# Altium project TeensyBreakoutTemplate.PrjPcb
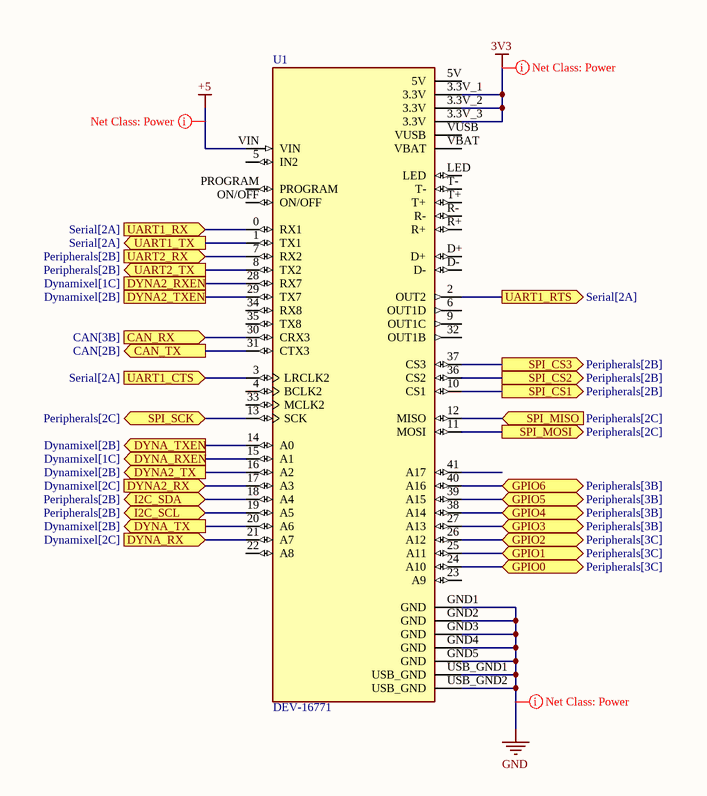
[diagram p0: Main.SchDoc]
6 sheets, 30 parts. Net scope: flat (ports and power ports of the same name join across sheets).
Board file: PCB.PcbDoc
Sheets:
  Main.SchDoc
  Power.SchDoc
  Serial.SchDoc
  Peripherals.SchDoc
  CAN.SchDoc
  Dynamixel.SchDoc

## Sheet Main.SchDoc
size A; SheetNumber: 1; SheetTotal: 6

### Parts
U1  DEV-16771  [MODULE_DEV-16771]

### Ports
CAN_RX (in, see CAN[3B]), CAN_TX (out, see CAN[2B]), DYNA2_RX (in, see Dynamixel[2C]), DYNA2_RXEN (see Dynamixel[1C]), DYNA2_TX (out, see Dynamixel[2B]), DYNA2_TXEN (see Dynamixel[2B]), DYNA_RX (in, see Dynamixel[2C]), DYNA_RXEN (out, see Dynamixel[1C]), DYNA_TX (out, see Dynamixel[2B]), DYNA_TXEN (out, see Dynamixel[2B]), GPIO0 (bidir, see Peripherals[3C]), GPIO1 (bidir, see Peripherals[3C]), GPIO2 (bidir, see Peripherals[3C]), GPIO3 (bidir, see Peripherals[3B]), GPIO4 (bidir, see Peripherals[3B]), GPIO5 (bidir, see Peripherals[3B]), GPIO6 (bidir, see Peripherals[3B]), I2C_SCL (bidir, see Peripherals[2B]), I2C_SDA (bidir, see Peripherals[2B]), SPI_CS1 (out, see Peripherals[2B]), SPI_CS2 (out, see Peripherals[2B]), SPI_CS3 (out, see Peripherals[2B]), SPI_MISO (in, see Peripherals[2C]), SPI_MOSI (out, see Peripherals[2C]), SPI_SCK (bidir, see Peripherals[2C]), UART1_CTS (in, see Serial[2A]), UART1_RTS (out, see Serial[2A]), UART1_RX (in, see Serial[2A]), UART1_TX (out, see Serial[2A]), UART2_RX (in, see Peripherals[2B]), UART2_TX (out, see Peripherals[2B])

### Nets
3V3: U1.3.3V_1(3.3V) U1.3.3V_2(3.3V) U1.3.3V_3(3.3V)
+5: U1.VIN
GND: U1.GND1(GND) U1.GND2(GND) U1.GND3(GND) U1.GND4(GND) U1.GND5(GND) U1.USB_GND1(USB_GND) U1.USB_GND2(USB_GND)
NetIC1_1: U1.14(A0) ; port DYNA_TXEN
NetIC1_2: U1.20(A6) ; port DYNA_TX
NetIC1_4: U1.29(TX7) ; port DYNA2_TXEN
NetIC1_5: U1.16(A2) ; port DYNA2_TX
NetIC2_1: U1.15(A1) ; port DYNA_RXEN
NetIC2_3: U1.21(A7) ; port DYNA_RX
NetIC2_4: U1.28(RX7) ; port DYNA2_RXEN
NetIC2_6: U1.17(A3) ; port DYNA2_RX
NetJ1_3: U1.7(RX2) ; port UART2_RX
NetJ1_4: U1.8(TX2) ; port UART2_TX
NetJ1_5: U1.18(A4) ; port I2C_SDA
NetJ1_6: U1.19(A5) ; port I2C_SCL
NetJ1_7: U1.37(CS3) ; port SPI_CS3
NetJ1_8: U1.36(CS2) ; port SPI_CS2
NetJ1_9: U1.10(CS1) ; port SPI_CS1
NetJ1_10: U1.13(SCK) ; port SPI_SCK
NetJ1_11: U1.12(MISO) ; port SPI_MISO
NetJ1_12: U1.11(MOSI) ; port SPI_MOSI
NetJ2_6: U1.40(A16) ; port GPIO6
NetJ2_7: U1.39(A15) ; port GPIO5
NetJ2_8: U1.38(A14) ; port GPIO4
NetJ2_9: U1.27(A13) ; port GPIO3
NetJ2_10: U1.26(A12) ; port GPIO2
NetJ2_11: U1.25(A11) ; port GPIO1
NetJ2_12: U1.24(A10) ; port GPIO0
NetU1_0: U1.0(RX1) ; port UART1_RX
NetU1_1: U1.1(TX1) ; port UART1_TX
NetU1_2: U1.2(OUT2) ; port UART1_RTS
NetU1_3: U1.3(LRCLK2) ; port UART1_CTS
NetU1_30: U1.30(CRX3) ; port CAN_RX
NetU1_31: U1.31(CTX3) ; port CAN_TX

Not connected (* = marked no-connect by the designer): U1 4(BCLK2) 5(IN2) 5V 6(OUT1D) 9(OUT1C) 22(A8) 23(A9) 32(OUT1B) 33(MCLK2) 34(RX8) 35(TX8) 41(A17) D+ D- LED ON/OFF PROGRAM R+ R- T+ T- VBAT VUSB

### Layout directives
net class Power: 3V3, +5, GND

### Library data of the parts
U1 = DEV-16771: RT1062 Teensy 4.1 i.MX ARM Cortex-M7 MPU Embedded Evaluation Board; MF: {'manufacturer': u'SparkFun Electronics'}; Package: None; Availability: Unavailable; Value: *; MP: DEV-16771; Price: None

## Sheet Power.SchDoc
size A; SheetNumber: 2; SheetTotal: 6
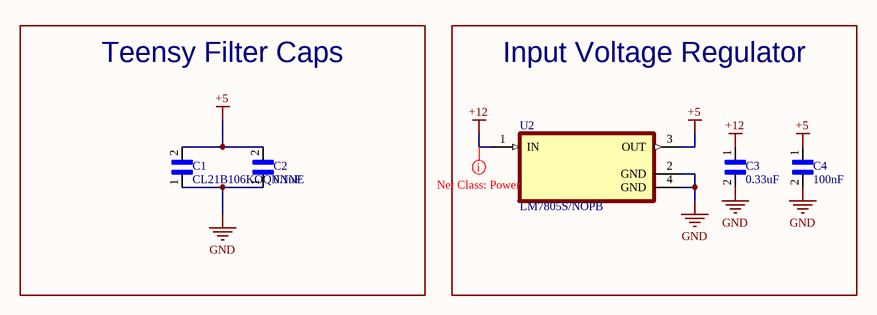
[diagram p1: Power.SchDoc]

### Parts
C1  CL21B106KOQNNNE  [CAPC2012X140N]
C2  0.1uF  [CAPC2012X140N]
C3  0.33uF  [CAPC2012X100N]
C4  100nF  [CAPC2012X140N]
U2  LM7805S/NOPB  [TO254P1524X483-4N]

### Blocks framed on the sheet
Teensy Filter Caps: C1 C2
Input Voltage Regulator: C3 C4 U2

### Nets
+5: C1.2 C2.2 C4.1 U2.3(OUT)
+12: C3.1 U2.1(IN)
GND: C1.1 C2.1 C3.2 C4.2 U2.2(GND) U2.4(GND)

### Layout directives
net class Power: +12

### Library data of the parts
C1 = CL21B106KOQNNNE: Cap Ceramic 10uF 16V X7R 10% Pad SMD 0805 125C T/R; MF: {'manufacturer': u'Samsung'}; Package: None; Availability: Unavailable; Value: *; MP: CL21B106KOQNNNE; Price: None
C2 C4 = 08055G104ZAT1A: CAPACITOR, 0805, 100NF, 50V; Capacitor Application:General Purpose; Dielectric Characteristic:Y5V; Capacitance:0.1ÂµF; Capacitance Tolerance:-20% to +80%; Voltage Rating:50V; Capacitor Case Style:0805; Capacitor Mounting:SMD; Operating Temperature Range:-25Â°C to +85Â°C; SVHC:No SVHC (15-Dec-2010); External Depth:0.95mm; External Length / Height:2mm; External Width:1.25mm; Insulation Resistance:10000Mohm; No. of Pins:2; Operating Temperature Max:85Â°C; Operating Temperature Min:-25Â°C; Package / Case:0805; Reel Quantity:3000; Tape Width:8mm; Temperature Coefficient:+22%, -82%; Terminal Type:Surface Mount (SMD, SMT); Termination Type:SMD; Tolerance +:80%; Tolerance -:20%; Voltage Rating VDC:50V; MF: {'manufacturer': u'AVX'}; Package: None; Availability: Unavailable; Value: *; MP: 08055G104ZAT1A; Price: None
C3 = C0805C334J5RECAUTO: MF: {'manufacturer': u'KEMET'}; Value: *; Package: None; MP: C0805C334J5RECAUTO; Availability: Unavailable; Price: None
U2 = LM7805S/NOPB: MF: {'manufacturer': u'Texas Instruments'}; Price: None; Package: None; Availability: Unavailable; MP: LM7805S/NOPB; Value: *

## Sheet Serial.SchDoc
size A; SheetNumber: 3; SheetTotal: 6
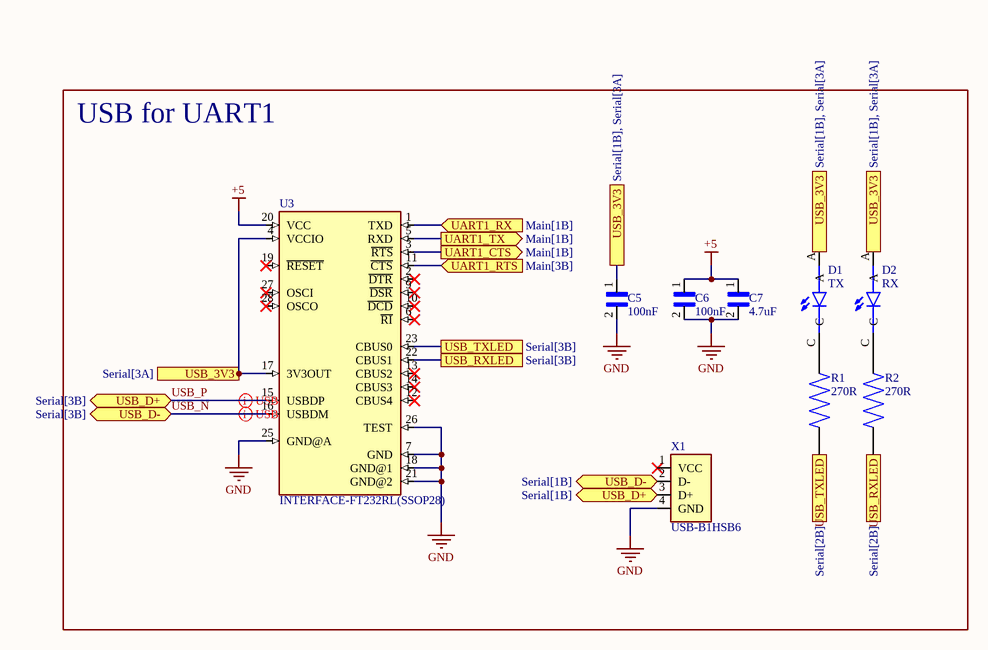
[diagram p2: Serial.SchDoc]

### Parts
C5  100nF  [CAPC2012X140N]
C6  100nF  [CAPC2012X140N]
C7  4.7uF  [CAPC2012X140N]
D1  TX  [LEDC3216X110]
D2  RX  [LEDC3216X110]
R1  270R  [RESC2012X55N]
R2  270R  [RESC2012X55N]
U3  INTERFACE-FT232RL(SSOP28)  [SSOP28-0.65-10.2X5.2MM]
X1  USB-B1HSB6  [OST_USB-B1HSB6]

### Blocks framed on the sheet
USB for UART1: C5-C7 D1 D2 R1 R2 U3 X1

### Ports
UART1_CTS (out, see Main[1B]), UART1_RTS (in, see Main[3B]), UART1_RX (in, see Main[1B]), UART1_TX (out, see Main[1B]), USB_3V3 (see Serial[1B], Serial[3A]), USB_3V3 (see Serial[3A]), USB_D+ (bidir, see Serial[1B]), USB_D+ (bidir, see Serial[3B]), USB_D- (bidir, see Serial[1B]), USB_D- (bidir, see Serial[3B]), USB_RXLED (see Serial[2B]), USB_RXLED (see Serial[3B]), USB_TXLED (see Serial[2B]), USB_TXLED (see Serial[3B])

### Nets
+5: C6.1 C7.1 U3.20(VCC)
GND: C5.2 C6.2 C7.2 U3.7(GND) U3.18(GND@1) U3.21(GND@2) U3.25(GND@A) U3.26(TEST) X1.4(GND)
USB_N: U3.16(USBDM) X1.2(D-) ; port USB_D-
USB_P: U3.15(USBDP) X1.3(D+) ; port USB_D+
NetC5_1: C5.1 D1.A D2.A U3.4(VCCIO) U3.17(3V3OUT) ; port USB_3V3
NetD1_C: D1.C R1.2
NetD2_C: D2.C R2.2
NetR1_1: R1.1 U3.23(CBUS0) ; port USB_TXLED
NetR2_1: R2.1 U3.22(CBUS1) ; port USB_RXLED
NetU1_0: U3.1(TXD) ; port UART1_RX
NetU1_1: U3.5(RXD) ; port UART1_TX
NetU1_2: U3.11(~{CTS}) ; port UART1_RTS
NetU1_3: U3.3(~{RTS}) ; port UART1_CTS

Not connected (* = marked no-connect by the designer): U3 2(~{DTR})* 6(~{RI})* 9(~{DSR})* 10(~{DCD})* 12(CBUS4)* 13(CBUS2)* 14(CBUS3)* 19(~{RESET})* 27(OSCI)* 28(OSCO)*; X1 1(VCC)*

### Layout directives
differential pair: USB_N, USB_P

### Library data of the parts
C5 C6 = 08055G104ZAT1A: as C2 on sheet Power; Package: None; Availability: Unavailable; Value: *; MP: 08055G104ZAT1A; Price: None
C7 = CL21A475KOCLRNC: 0805 X5R 4.7UF 10% 16V; MF: {'manufacturer': u'Samsung'}; Value: *; Availability: Unavailable; Price: None; Package: None; MP: CL21A475KOCLRNC
D1 D2 = LTST-C230KRKT: LED SMT RED CLR 1206 TAPE; MF: {'manufacturer': u'Lite-On Electronics'}; Package: None; MP: LTST-C230KRKT; Value: *; Availability: Unavailable; Price: None
R1 R2 = TNPW0805270RBETA: MF: {'manufacturer': u'Vishay'}; MP: TNPW0805270RBETA; Availability: Unavailable; Package: None; Value: *; Price: None
U3 = INTERFACE-FT232RL(SSOP28): 310070022; MF: {'manufacturer': u'FTDI, Future'}; Price: None; Value: *; MP: FT232RL; Availability: Unavailable; Package: None
X1 = USB-B1HSB6: Conn Usb Type b r/a Black; MF: {'manufacturer': u'On Shore'}; MP: USB-B1HSB6; Availability: Unavailable; Package: None; Value: *; Price: None

## Sheet Peripherals.SchDoc
size A; SheetNumber: 4; SheetTotal: 6
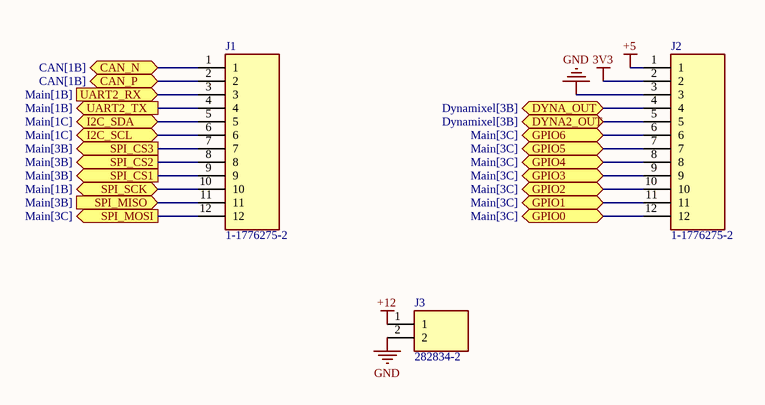
[diagram p3: Peripherals.SchDoc]

### Parts
J1  1-1776275-2  [117762752]
J2  1-1776275-2  [117762752]
J3  282834-2  [282834-2_1]

### Ports
CAN_N (bidir, see CAN[1B]), CAN_P (bidir, see CAN[1B]), DYNA2_OUT (bidir, see Dynamixel[3B]), DYNA_OUT (bidir, see Dynamixel[3B]), GPIO0 (bidir, see Main[3C]), GPIO1 (bidir, see Main[3C]), GPIO2 (bidir, see Main[3C]), GPIO3 (bidir, see Main[3C]), GPIO4 (bidir, see Main[3C]), GPIO5 (bidir, see Main[3C]), GPIO6 (bidir, see Main[3C]), I2C_SCL (bidir, see Main[1C]), I2C_SDA (bidir, see Main[1C]), SPI_CS1 (out, see Main[3B]), SPI_CS2 (out, see Main[3B]), SPI_CS3 (out, see Main[3B]), SPI_MISO (in, see Main[3B]), SPI_MOSI (out, see Main[3C]), SPI_SCK (bidir, see Main[1B]), UART2_RX (in, see Main[1B]), UART2_TX (out, see Main[1B])

### Nets
3V3: J2.2
+5: J2.1
+12: J3.1
GND: J2.3 J3.2
CAN_N: J1.1 ; port CAN_N
CAN_P: J1.2 ; port CAN_P
NetIC1_3: J2.4 ; port DYNA_OUT
NetIC1_6: J2.5 ; port DYNA2_OUT
NetJ1_3: J1.3 ; port UART2_RX
NetJ1_4: J1.4 ; port UART2_TX
NetJ1_5: J1.5 ; port I2C_SDA
NetJ1_6: J1.6 ; port I2C_SCL
NetJ1_7: J1.7 ; port SPI_CS3
NetJ1_8: J1.8 ; port SPI_CS2
NetJ1_9: J1.9 ; port SPI_CS1
NetJ1_10: J1.10 ; port SPI_SCK
NetJ1_11: J1.11 ; port SPI_MISO
NetJ1_12: J1.12 ; port SPI_MOSI
NetJ2_6: J2.6 ; port GPIO6
NetJ2_7: J2.7 ; port GPIO5
NetJ2_8: J2.8 ; port GPIO4
NetJ2_9: J2.9 ; port GPIO3
NetJ2_10: J2.10 ; port GPIO2
NetJ2_11: J2.11 ; port GPIO1
NetJ2_12: J2.12 ; port GPIO0

### Library data of the parts
J1 J2 = 1-1776275-2: Connector; Manufacturer_Name: TE Connectivity; Datasheet Link: https://www.mouser.com/datasheet/2/418/NG_CD_1776275_R1-659562.pdf; Height: 8.6mm; Manufacturer_Part_Number: 1-1776275-2; Mouser Part Number: 571-1-1776275-2; Mouser Price/Stock: https://www.mouser.co.uk/ProductDetail/TE-Connectivity/1-1776275-2?qs=GQ3BsEl46pl%2F8gdkKRu%2FaA%3D%3D
J3 = 282834-2: Connector; Manufacturer_Name: TE Connectivity; Datasheet Link: https://www.te.com/commerce/DocumentDelivery/DDEController?Action=srchrtrv&DocNm=1-1773458-1_EURO_STYLE_QRG&DocType=Data+Sheet&DocLang=English&PartCntxt=282834-2&DocFormat=pdf; Manufacturer_Part_Number: 282834-2; Mouser Part Number: 571-282834-2; Mouser Price/Stock: https://www.mouser.co.uk/ProductDetail/TE-Connectivity/282834-2?qs=A%252Bip%252BNCYi6N8cVKuk8xDog%3D%3D; Arrow Part Number: 282834-2; Arrow Price/Stock: https://www.arrow.com/en/products/282834-2/te-connectivity?region=europe

## Sheet CAN.SchDoc
size A; SheetNumber: 5; SheetTotal: 6
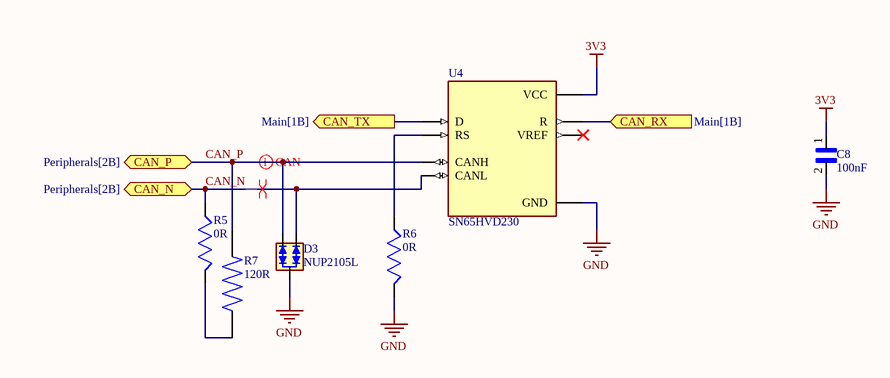
[diagram p4: CAN.SchDoc]

### Parts
C8  100nF  [CAPC2012X140N]
D3  NUP2105L  [SOT23]
R5  0R  [RESC2012X60]
R6  0R  [RESC2012X60]
R7  120R  [RESC2012X65N]
U4  SN65HVD230  [SOIC127P599X175-8N]

### Ports
CAN_N (bidir, see Peripherals[2B]), CAN_P (bidir, see Peripherals[2B]), CAN_RX (in, see Main[1B]), CAN_TX (out, see Main[1B])

### Nets
3V3: C8.1 U4.3(VCC)
GND: C8.2 D3.3(GND) R6.1 U4.2(GND)
CAN_N: D3.1(CANH) R5.2 U4.6(CANL) ; port CAN_N
CAN_P: D3.2(CANL) R7.2 U4.7(CANH) ; port CAN_P
NetR5_1: R5.1 R7.1
NetR6_2: R6.2 U4.8(RS)
NetU1_30: U4.4(R) ; port CAN_RX
NetU1_31: U4.1(D) ; port CAN_TX

Not connected (* = marked no-connect by the designer): U4 5(VREF)*

### Layout directives
differential pair: CAN_N, CAN_P

### Library data of the parts
C8 = 08055G104ZAT1A: as C2 on sheet Power; Package: None; Availability: Unavailable; Value: *; MP: 08055G104ZAT1A; Price: None
D3 = NUP2105L: MF: {'manufacturer': u'Diotec Semiconductor'}; Value: *; MP: NUP2105L; Availability: Unavailable; Package: None; Price: None
R5 R6 = RC0805JR-7W0RL: RC Series 0805 0.125 W 2 kOhms 5% Â±100 ppm/Â°C SMT Thick Film Chip Resistor; MF: {'manufacturer': u'Yageo'}; Package: None; MP: RC0805JR-7W0RL; Value: *; Price: None; Availability: Unavailable
R7 = 1-2176327-4: Fixed Resistor CRGP 0805 120R 1%; MF: {'manufacturer': u'TE Connectivity'}; Package: None; MP: 1-2176327-4; Value: *; Price: None; Availability: Unavailable
U4 = SN65HVD230: the sn65hvd230 sn65hvd231 and sn65hvd232 controller area network (can) transceivers are designed for use with the tex...; MF: {'manufacturer': u'Texas Instruments'}; Value: *; Package: None; MP: SN65HVD230; Availability: Unavailable; Price: None

## Sheet Dynamixel.SchDoc
size A; SheetNumber: 6; SheetTotal: 6
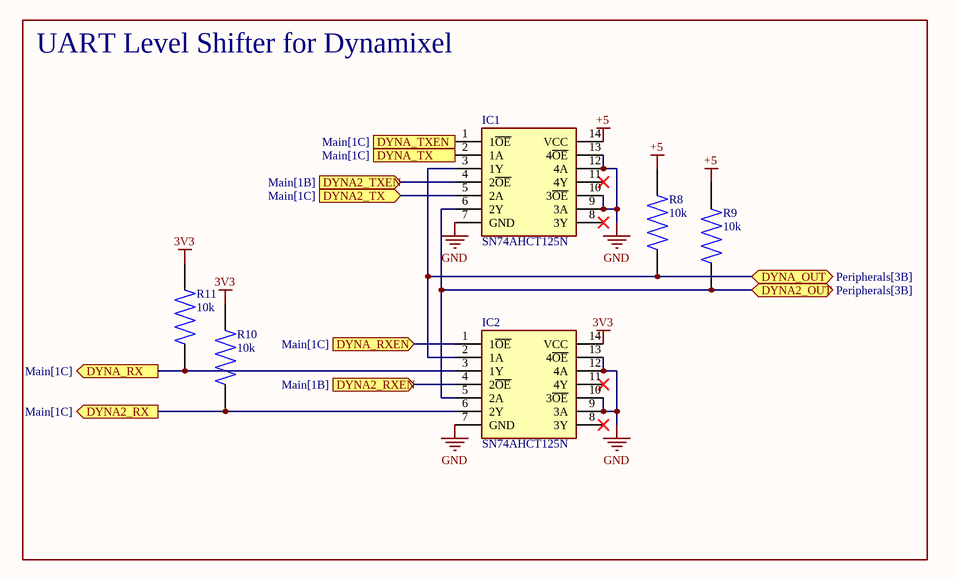
[diagram p5: Dynamixel.SchDoc]

### Parts
IC1  SN74AHCT125N  [DIP794W53P254L1930H508Q14N]
IC2  SN74AHCT125N  [DIP794W53P254L1930H508Q14N]
R8  10k  [RESC2012X55N]
R9  10k  [RESC2012X55N]
R10  10k  [RESC2012X55N]
R11  10k  [RESC2012X55N]

### Blocks framed on the sheet
UART Level Shifter for Dynamixel: IC1 IC2 R8-R11

### Ports
DYNA2_OUT (bidir, see Peripherals[3B]), DYNA2_RX (out, see Main[1C]), DYNA2_RXEN (in, see Main[1B]), DYNA2_TX (in, see Main[1C]), DYNA2_TXEN (in, see Main[1B]), DYNA_OUT (bidir, see Peripherals[3B]), DYNA_RX (out, see Main[1C]), DYNA_RXEN (in, see Main[1C]), DYNA_TX (in, see Main[1C]), DYNA_TXEN (in, see Main[1C])

### Nets
3V3: IC2.14(VCC) R10.2 R11.2
+5: IC1.14(VCC) R8.2 R9.2
GND: IC1.7(GND) IC1.9(3A) IC1.10(3~{OE}) IC1.12(4A) IC1.13(4~{OE}) IC2.7(GND) IC2.9(3A) IC2.10(3~{OE}) IC2.12(4A) IC2.13(4~{OE})
NetIC1_1: IC1.1(1~{OE}) ; port DYNA_TXEN
NetIC1_2: IC1.2(1A) ; port DYNA_TX
NetIC1_3: IC1.3(1Y) IC2.2(1A) R8.1 ; port DYNA_OUT
NetIC1_4: IC1.4(2~{OE}) ; port DYNA2_TXEN
NetIC1_5: IC1.5(2A) ; port DYNA2_TX
NetIC1_6: IC1.6(2Y) IC2.5(2A) R9.1 ; port DYNA2_OUT
NetIC2_1: IC2.1(1~{OE}) ; port DYNA_RXEN
NetIC2_3: IC2.3(1Y) R11.1 ; port DYNA_RX
NetIC2_4: IC2.4(2~{OE}) ; port DYNA2_RXEN
NetIC2_6: IC2.6(2Y) R10.1 ; port DYNA2_RX

Not connected (* = marked no-connect by the designer): IC1 8(3Y)* 11(4Y)*; IC2 8(3Y)* 11(4Y)*

### Library data of the parts
IC1 IC2 = SN74AHCT125N: Integrated Circuit; Manufacturer_Name: Texas Instruments; Datasheet Link: http://www.ti.com/lit/gpn/sn74ahct125; Height: 5.08mm; Manufacturer_Part_Number: SN74AHCT125N; Mouser Part Number: 595-SN74AHCT125N; Mouser Price/Stock: https://www.mouser.co.uk/ProductDetail/Texas-Instruments/SN74AHCT125N?qs=1wQRf3HkBjyxwrHMwAiMfw%3D%3D; Arrow Part Number: SN74AHCT125N; Arrow Price/Stock: https://www.arrow.com/en/products/sn74ahct125n/texas-instruments?region=nac
R8-R11 = TNPW0805270RBETA: MF: {'manufacturer': u'Vishay'}; MP: TNPW0805270RBETA; Availability: Unavailable; Package: None; Value: *; Price: None

## Nets that join several sheets
3V3: Main (U1.3.3V_1 U1.3.3V_2 U1.3.3V_3), Peripherals (J2.2), CAN (C8.1 U4.3), Dynamixel (IC2.14 R10.2 R11.2)
+5: Main (U1.VIN), Power (C1.2 C2.2 C4.1 U2.3), Serial (C6.1 C7.1 U3.20), Peripherals (J2.1), Dynamixel (IC1.14 R8.2 R9.2)
+12: Power (C3.1 U2.1), Peripherals (J3.1)
GND: Main (7 pins), Power (6 pins), Serial (9 pins), Peripherals (J2.3 J3.2), CAN (C8.2 D3.3 R6.1 U4.2), Dynamixel (10 pins)
CAN_N: Peripherals (J1.1), CAN (D3.1 R5.2 U4.6)
CAN_P: Peripherals (J1.2), CAN (D3.2 R7.2 U4.7)
NetIC1_1: Main (U1.14), Dynamixel (IC1.1)
NetIC1_2: Main (U1.20), Dynamixel (IC1.2)
NetIC1_3: Peripherals (J2.4), Dynamixel (IC1.3 IC2.2 R8.1)
NetIC1_4: Main (U1.29), Dynamixel (IC1.4)
NetIC1_5: Main (U1.16), Dynamixel (IC1.5)
NetIC1_6: Peripherals (J2.5), Dynamixel (IC1.6 IC2.5 R9.1)
NetIC2_1: Main (U1.15), Dynamixel (IC2.1)
NetIC2_3: Main (U1.21), Dynamixel (IC2.3 R11.1)
NetIC2_4: Main (U1.28), Dynamixel (IC2.4)
NetIC2_6: Main (U1.17), Dynamixel (IC2.6 R10.1)
NetJ1_3: Main (U1.7), Peripherals (J1.3)
NetJ1_4: Main (U1.8), Peripherals (J1.4)
NetJ1_5: Main (U1.18), Peripherals (J1.5)
NetJ1_6: Main (U1.19), Peripherals (J1.6)
NetJ1_7: Main (U1.37), Peripherals (J1.7)
NetJ1_8: Main (U1.36), Peripherals (J1.8)
NetJ1_9: Main (U1.10), Peripherals (J1.9)
NetJ1_10: Main (U1.13), Peripherals (J1.10)
NetJ1_11: Main (U1.12), Peripherals (J1.11)
NetJ1_12: Main (U1.11), Peripherals (J1.12)
NetJ2_6: Main (U1.40), Peripherals (J2.6)
NetJ2_7: Main (U1.39), Peripherals (J2.7)
NetJ2_8: Main (U1.38), Peripherals (J2.8)
NetJ2_9: Main (U1.27), Peripherals (J2.9)
NetJ2_10: Main (U1.26), Peripherals (J2.10)
NetJ2_11: Main (U1.25), Peripherals (J2.11)
NetJ2_12: Main (U1.24), Peripherals (J2.12)
NetU1_0: Main (U1.0), Serial (U3.1)
NetU1_1: Main (U1.1), Serial (U3.5)
NetU1_2: Main (U1.2), Serial (U3.11)
NetU1_3: Main (U1.3), Serial (U3.3)
NetU1_30: Main (U1.30), CAN (U4.4)
NetU1_31: Main (U1.31), CAN (U4.1)